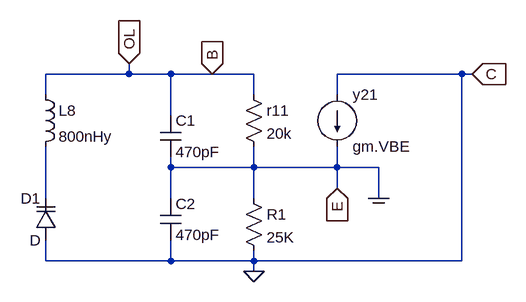
[diagram p0: schematic oscilador_res.asc]
oscilador_res.asc, the LTspice schematic file:
Version 4
SHEET 1 880 800
WIRE -352 -288 -352 -304
WIRE -352 -288 -480 -288
WIRE -288 -288 -352 -288
WIRE -224 -288 -288 -288
WIRE -160 -288 -224 -288
WIRE 160 -288 -32 -288
WIRE 176 -288 160 -288
WIRE -480 -256 -480 -288
WIRE -160 -256 -160 -288
WIRE -32 -256 -32 -288
WIRE -288 -224 -288 -288
WIRE -288 -144 -288 -160
WIRE -160 -144 -160 -176
WIRE -160 -144 -288 -144
WIRE -32 -144 -32 -176
WIRE -32 -144 -160 -144
WIRE 32 -144 -32 -144
WIRE -32 -112 -32 -144
WIRE -480 -96 -480 -176
WIRE -288 -96 -288 -144
WIRE -160 -96 -160 -144
WIRE 32 -96 32 -144
WIRE -480 0 -480 -32
WIRE -288 0 -288 -32
WIRE -288 0 -480 0
WIRE -160 0 -160 -16
WIRE -160 0 -288 0
WIRE 160 0 160 -288
WIRE 160 0 -160 0
WIRE -160 16 -160 0
FLAG -160 16 0
FLAG -352 -304 OL
IOPIN -352 -304 In
FLAG -224 -288 B
IOPIN -224 -288 In
FLAG 176 -288 C
IOPIN 176 -288 In
FLAG -32 -112 E
IOPIN -32 -112 In
FLAG 32 -96 COM
SYMBOL cap -304 -224 R0
SYMATTR InstName C1
SYMATTR Value 470pF
SYMBOL cap -304 -96 R0
SYMATTR InstName C2
SYMATTR Value 470pF
SYMBOL ind -496 -272 R0
SYMATTR InstName L8
SYMATTR Value 800nHy
SYMBOL res -176 -112 R0
SYMATTR InstName R1
SYMATTR Value 25K
SYMBOL res -176 -272 R0
SYMATTR InstName r11
SYMATTR Value 20k
SYMBOL current -32 -256 R0
WINDOW 123 0 0 Left 0
WINDOW 39 0 0 Left 0
SYMATTR InstName y21
SYMATTR Value gm.VBE
SYMBOL varactor -464 -32 R180
WINDOW 0 24 64 Left 2
WINDOW 3 24 0 Left 2
SYMATTR InstName D1

The netlist it stands for:
* oscilador_res.asc
C1 B COM 470pF
C2 COM 0 470pF
L8 B N001 800nHy
R1 COM 0 25K
r11 B COM 20k
I§y21 0 COM gm.VBE
D1 0 N001 D
.model D D
.lib standard.dio
.backanno
.end